# EAGLE schematic Driver Controls Board v1.4 (EAGLE 9.5.1)
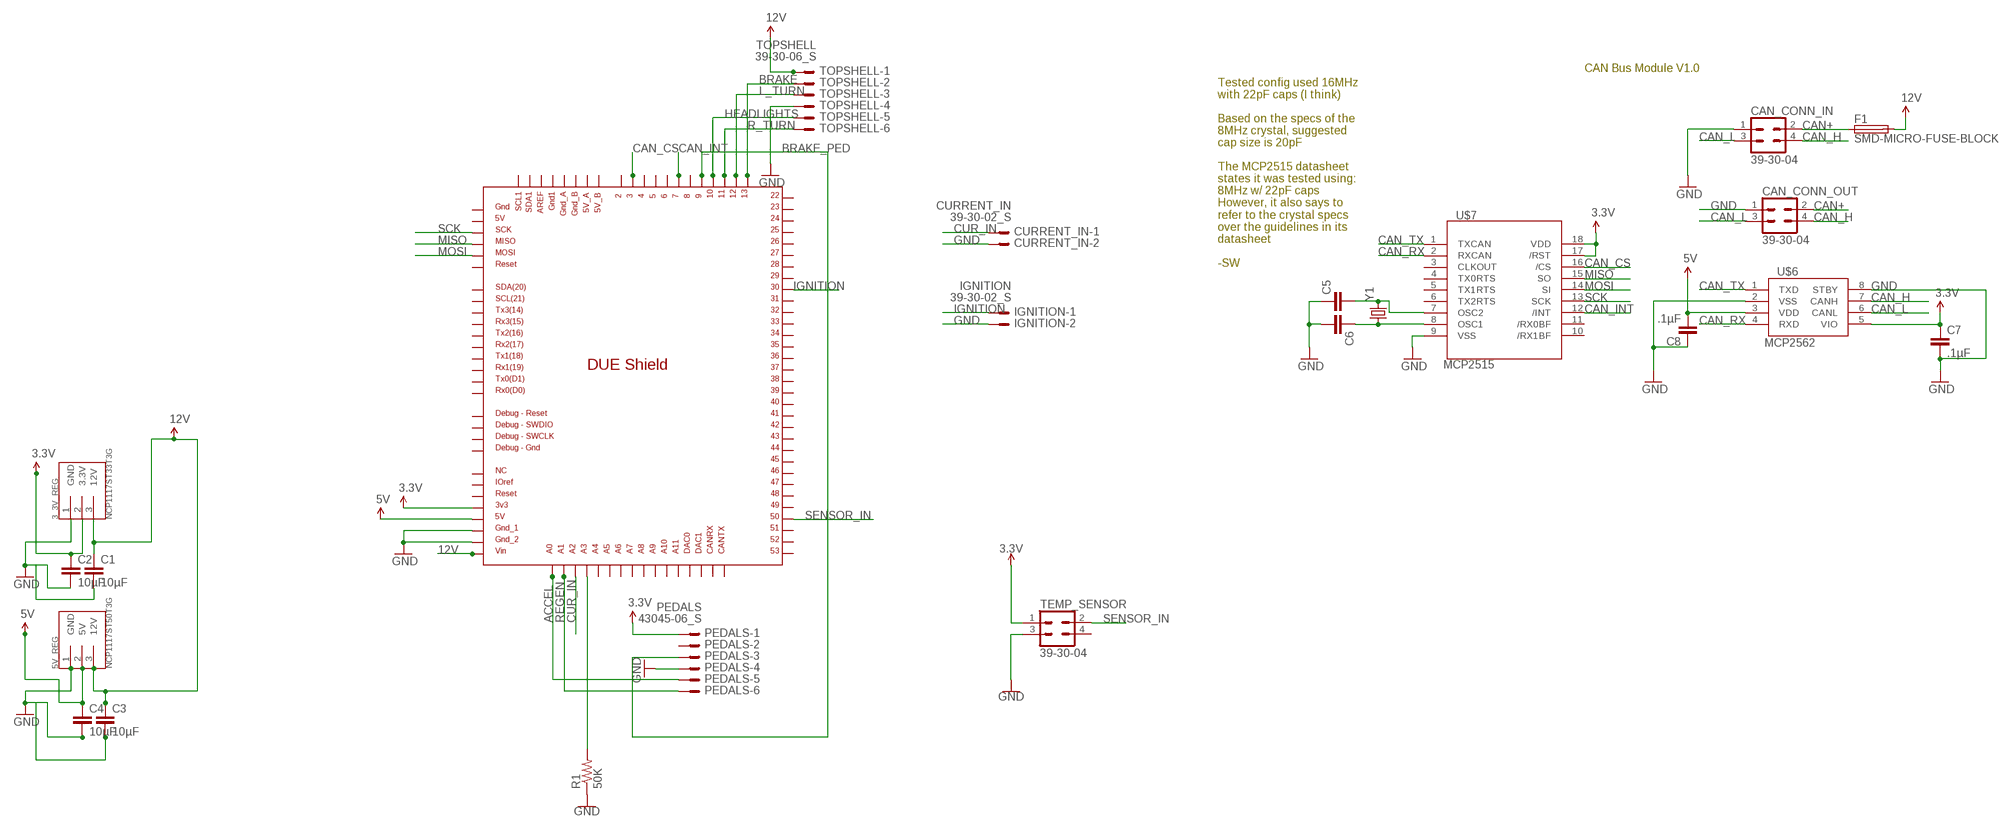
[diagram p0: schematic, sheet 1]

## Parts
3_3V_REG  NCP1117ST33T3G  [SOT223]
5V_REG  NCP1117ST50T3G  [SOT223]
C1  10µF  CAP0805  [0805]
C2  10µF  CAP0805  [0805]
C3  10µF  CAP0805  [0805]
C4  10µF  CAP0805  [0805]
C5  CAP0805  [0805]
C6  CAP0805  [0805]
C7  .1µF  CAP0805  [0805]
C8  .1µF  CAP0805  [0805]
CAN_CONN_IN  39-30-04  [39-30-?04?]
CAN_CONN_OUT  39-30-04  [39-30-?04?]
CURRENT_IN  39-30-02_S  [39-30-?02?]
F1  SMD-MICRO-FUSE-BLOCK  [OMNIBLOK]
IGNITION  39-30-02_S  [39-30-?02?]
PEDALS  43045-06_S  [43045-06]
R1  50K  R-US_VTA55  [VTA55]
TEMP_SENSOR  39-30-04  [39-30-?04?]
TOPSHELL  39-30-06_S  [39-30-?06?]
U$2  DUE(NORMAL)  [DUE(NORMAL)]
U$6  MCP2562  [SOIC8]
U$7  MCP2515  [SO-18W]
Y1  CRYSTALHC49US  [HC49US]

## Nets
3.3V: 3_3V_REG.2(3.3V) C2.1 C7.1 PEDALS.1 TEMP_SENSOR.1 U$2.3V3 U$6.5(VIO) U$7.17(/RST) U$7.18(VDD)
5V: 5V_REG.2(5V) C4.1 C8.2 U$2.5V U$6.3(VDD)
12V: 3_3V_REG.3(12V) 5V_REG.3(12V) C1.1 C3.1 F1.P$2 TOPSHELL.1 U$2.VIN
ACCEL: PEDALS.5 U$2.A0
BRAKE: TOPSHELL.2 U$2.13
BRAKE_PED: PEDALS.3 U$2.9
CAN+: CAN_CONN_IN.2 CAN_CONN_OUT.2 F1.P$1
CAN_CS: U$2.3 U$7.16(/CS)
CAN_H: CAN_CONN_IN.4 CAN_CONN_OUT.4 U$6.7(CANH)
CAN_INT: U$2.7 U$7.12(/INT)
CAN_L: CAN_CONN_IN.3 CAN_CONN_OUT.3 U$6.6(CANL)
CAN_RX: U$6.4(RXD) U$7.2(RXCAN)
CAN_TX: U$6.1(TXD) U$7.1(TXCAN)
CUR_IN: CURRENT_IN.1 U$2.A2
GND: 3_3V_REG.1(GND) 5V_REG.1(GND) C1.2 C2.2 C3.2 C4.2 C5.1 C6.2 C7.2 C8.1 CAN_CONN_IN.1 CAN_CONN_OUT.1 CURRENT_IN.2 IGNITION.2 PEDALS.4 R1.1 TEMP_SENSOR.3 TOPSHELL.4 U$2.GND_1 U$2.GND_2 U$6.2(VSS) U$6.8(STBY) U$7.9(VSS)
HEADLIGHTS: TOPSHELL.5 U$2.10
IGNITION: IGNITION.1 U$2.30
L_TURN: TOPSHELL.3 U$2.12
MISO: U$2.MISO_ICSP U$7.15(SO)
MOSI: U$2.MOSI_ICSP U$7.14(SI)
N$1: R1.2 U$2.A3
N$7: C5.2 U$7.7(OSC2) Y1.2
N$11: C6.1 U$7.8(OSC1) Y1.1
R_TURN: TOPSHELL.6 U$2.11
REGEN: PEDALS.6 U$2.A1
SCK: U$2.SCK_ICSP U$7.13(SCK)
SENSOR_IN: TEMP_SENSOR.2 U$2.50
Unconnected: PEDALS.2 TEMP_SENSOR.4 U$2.2 U$2.4 U$2.5 U$2.5V_A U$2.5V_B U$2.5V_ICSP U$2.6 U$2.8 U$2.22 U$2.23 U$2.24 U$2.25 U$2.26 U$2.27 U$2.28 U$2.29 U$2.31 U$2.32 U$2.33 U$2.34 U$2.35 U$2.36 U$2.37 U$2.38 U$2.39 U$2.40 U$2.41 U$2.42 U$2.43 U$2.44 U$2.45 U$2.46 U$2.47 U$2.48 U$2.49 U$2.51 U$2.52 U$2.53 U$2.A4 U$2.A5 U$2.A6 U$2.A7 U$2.A8 U$2.A9 U$2.A10 U$2.A11 U$2.AREF U$2.CANRX U$2.CANTX U$2.DAC0 U$2.DAC1 U$2.GND1 U$2.GND_A U$2.GND_B U$2.GND_DEBUG U$2.GND_ICSP U$2.IOREF U$2.NC U$2.RESET U$2.RESET_DEBUG U$2.RESET_ICSP U$2.RX0 U$2.RX1 U$2.RX2 U$2.RX3 U$2.SCL U$2.SCL1 U$2.SDA U$2.SDA1 U$2.SWCLK_DEBUG U$2.SWDIO_DEBUG U$2.TX0 U$2.TX1 U$2.TX2 U$2.TX3 U$7.3(CLKOUT) U$7.4(TX0RTS) U$7.5(TX1RTS) U$7.6(TX2RTS) U$7.10(/RX1BF) U$7.11(/RX0BF)

## Notes on the sheet
- CAN Bus Module V1.0
- Tested config used 16MHz
  with 22pF caps (I think)
  
  Based on the specs of the
  8MHz crystal, suggested
  cap size is 20pF
  
  The MCP2515 datasheet
  states it was tested using:
  8MHz w/ 22pF caps
  However, it also says to
  refer to the crystal specs
  over the guidelines in its
  datasheet
  
  -SW

## Library data of the parts
3_3V_REG = NUSOLAR_Custom:NCP1117ST33T3G
5V_REG = NUSOLAR_Custom:NCP1117ST50T3G
C1-C8 = SparkFun-Capacitors:CAP: Capacitor Standard 0603 ceramic capacitor, and 0.1" leaded capacitor.
CAN_CONN_IN CAN_CONN_OUT TEMP_SENSOR = con-molex-mini-fit:39-30-?04?: HEADER
CURRENT_IN IGNITION = con-molex-mini-fit:39-30-?02?_S: HEADER
F1 = f-lf-omniblok-s:SMD-MICRO-FUSE
PEDALS = con-molex-micro-fit:43045-06_S: HEADER
R1 = resistor:R-US_: RESISTOR, American symbol
TOPSHELL = con-molex-mini-fit:39-30-?06?_S: HEADER
U$2 = DUElib130425:DUE(NORMAL)
U$6 = NUSOLAR_Custom:MCP2562
U$7 = NUSOLAR_Custom:MCP2515
Y1 = SparkFun-FreqCtrl:CRYSTAL: Various standard crystals. Proven footprints.